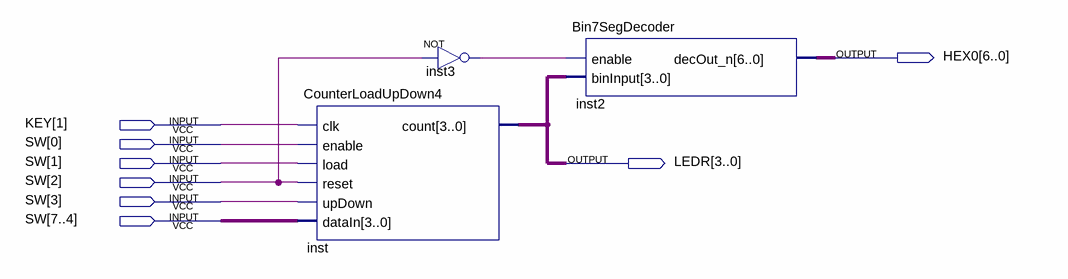
[diagram p0: schematic sheet]
// Quartus schematic Counter_Demo.bdf as structural Verilog: 3 symbols, 8 pins
module Counter_Demo (
  input  [1:1] KEY,
  input  [7:0] SW,
  output [6:0] HEX0,
  output [3:0] LEDR
);

  wire inst3_out;

  CounterLoadUpDown4 inst (
    .clk(KEY[1]), .enable(SW[0]), .load(SW[1]), .reset(SW[2]), .upDown(SW[3]), .dataIn(SW[7:4]), .count(LEDR));
  not inst3 (inst3_out, SW[2]);
  Bin7SegDecoder inst2 (.enable(inst3_out), .binInput(LEDR), .decOut_n(HEX0));
endmodule
